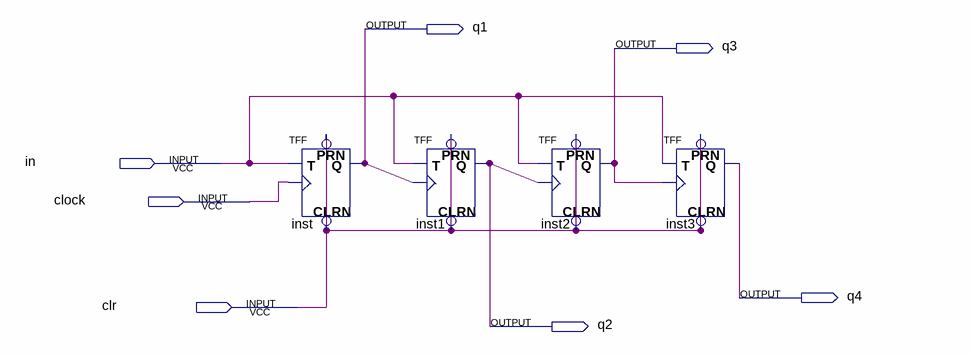
[diagram p0: schematic sheet]
// Quartus schematic question3b.bdf as structural Verilog: 4 symbols, 7 pins
module question3b (
  input  in,
  input  clock,
  input  clr,
  output q1,
  output q3,
  output q4,
  output q2
);

  TFF inst (.PRN(clr), .CLRN(clr), .T(in), .CLK(clock), .Q(q1));
  TFF inst1 (.PRN(clr), .CLRN(clr), .T(in), .CLK(q1), .Q(q2));
  TFF inst2 (.PRN(clr), .CLRN(clr), .T(in), .CLK(q2), .Q(q3));
  TFF inst3 (.PRN(clr), .CLRN(clr), .T(in), .CLK(q3), .Q(q4));
endmodule
